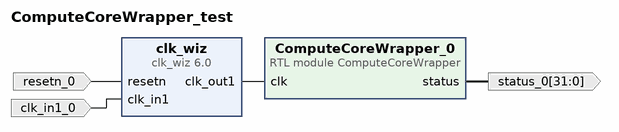
[diagram p0: block diagram of the top level]
# Vivado block design ComputeCoreWrapper_test, xc7k325tffg900-2, Vivado 2019.1
create_bd_design ComputeCoreWrapper_test

create_bd_port -dir I -type rst resetn_0
create_bd_port -dir I -type clk clk_in1_0
create_bd_port -dir O -from 31 -to 0 status_0

create_bd_cell -type ip -vlnv xilinx.com:ip:clk_wiz:6.0 clk_wiz
set_property -dict {CONFIG.RESET_PORT resetn CONFIG.RESET_TYPE ACTIVE_LOW} [get_bd_cells clk_wiz]
create_bd_cell -type module -reference ComputeCoreWrapper ComputeCoreWrapper_0

# ---- connections ----

connect_bd_net [get_bd_pins clk_wiz/clk_out1] [get_bd_pins ComputeCoreWrapper_0/clk]
connect_bd_net -net resetn_0_1 [get_bd_ports resetn_0] [get_bd_pins clk_wiz/resetn]
connect_bd_net -net clk_in1_0_1 [get_bd_ports clk_in1_0] [get_bd_pins clk_wiz/clk_in1]
connect_bd_net [get_bd_pins ComputeCoreWrapper_0/status] [get_bd_ports status_0]

validate_bd_design
save_bd_design
